# EAGLE design Płytka (EAGLE 9.6.2)
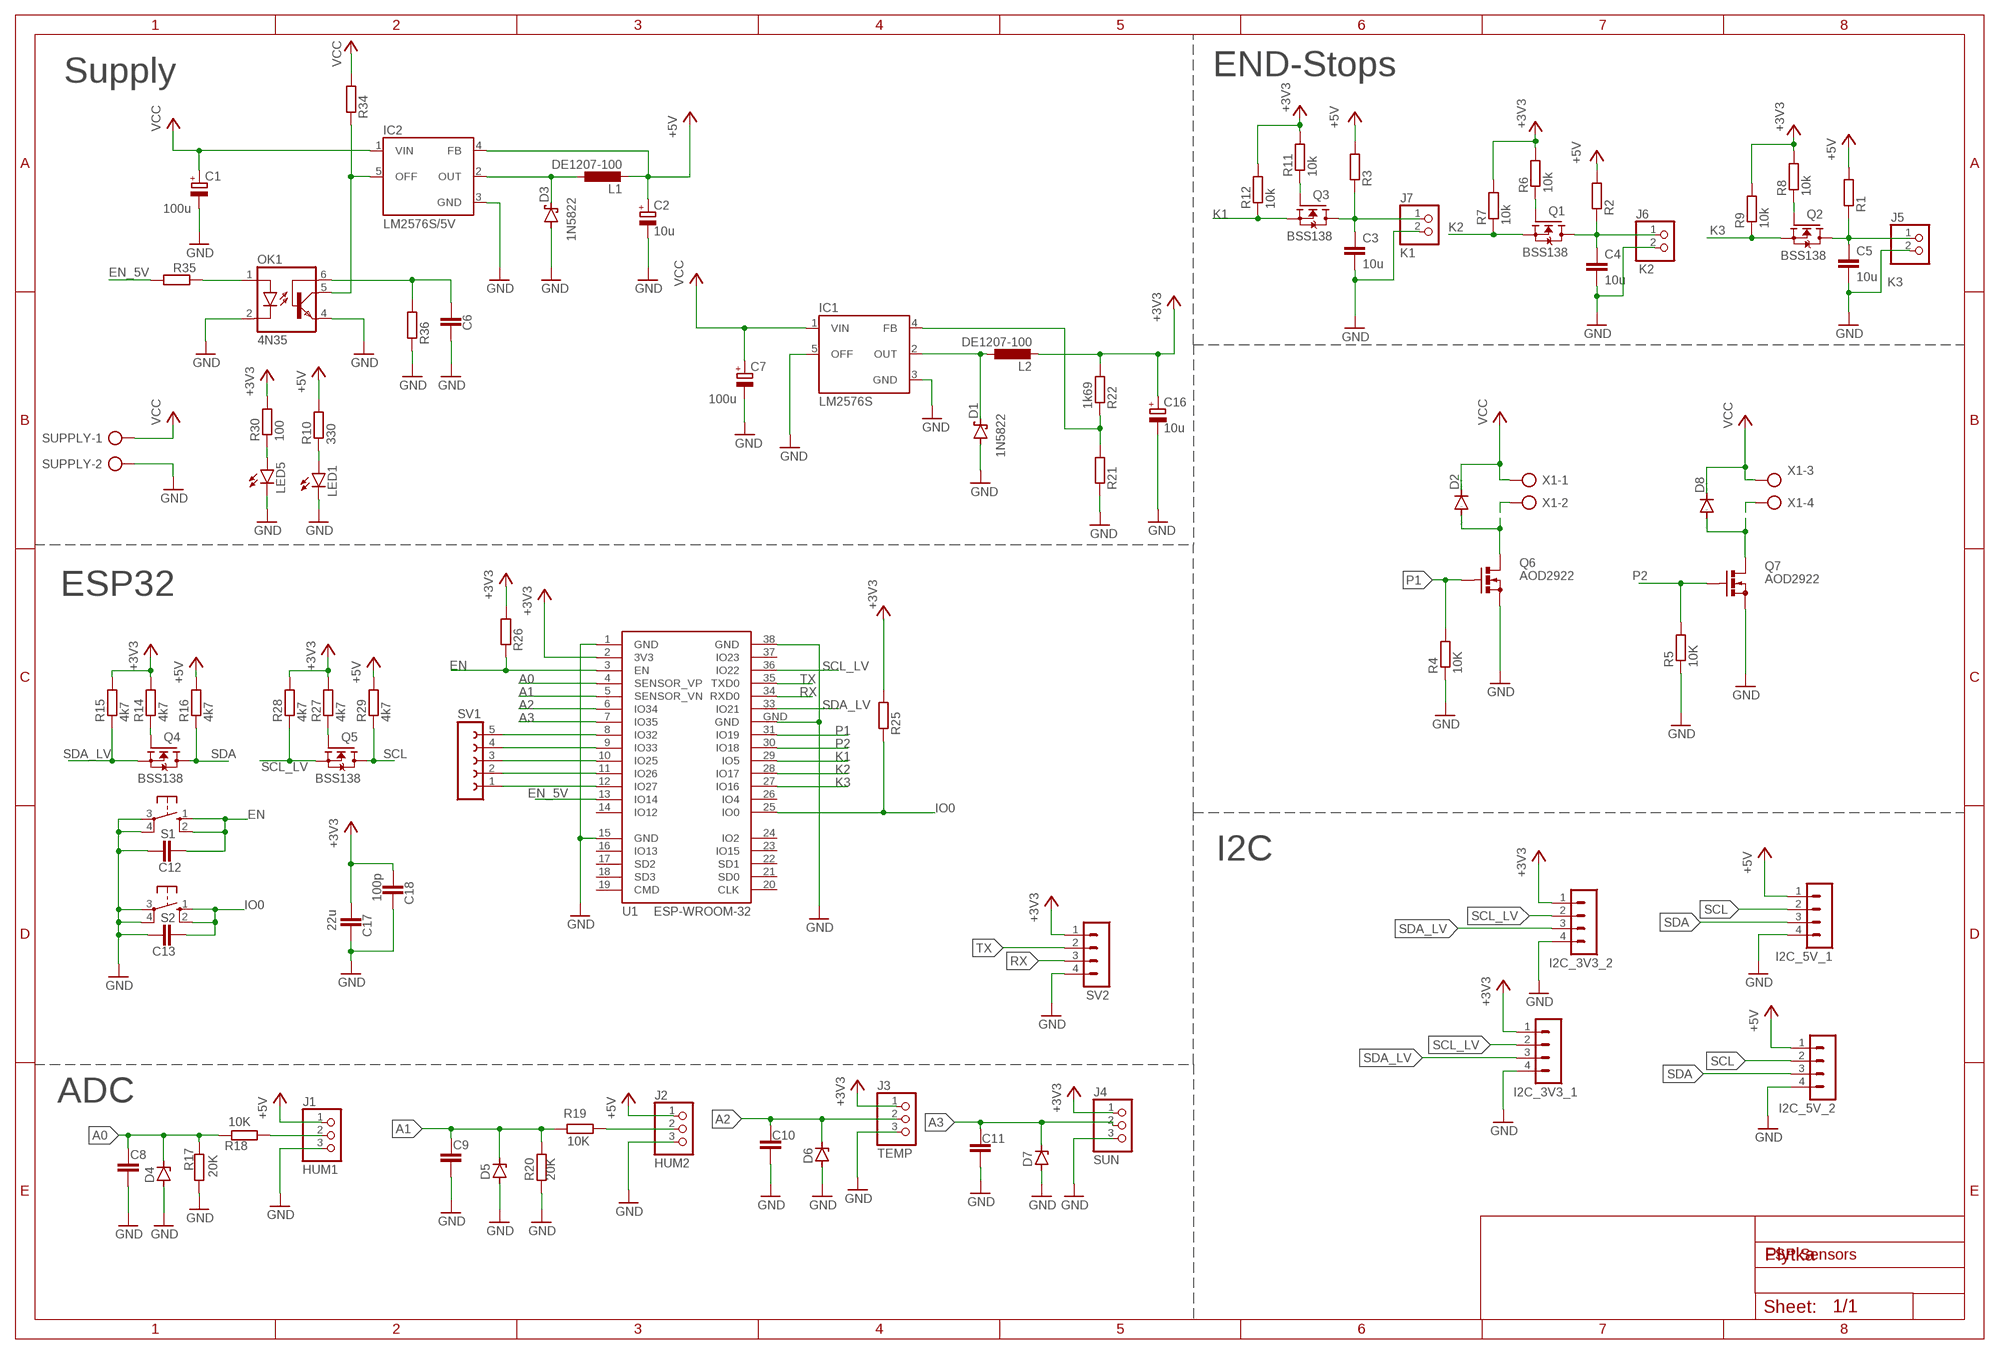
[diagram p0: schematic, sheet 1]

## Parts
C1  100u  CPOL-EUE2.5-6  [E2,5-6]
C2  10u  CPOL-EUE3.5-8  [E3,5-8]
C3  10u  C-EUC0805K  [C0805K]
C4  10u  C-EUC0805K  [C0805K]
C5  10u  C-EUC0805K  [C0805K]
C6  C-EUC0805K  [C0805K]
C7  100u  CPOL-EUE2.5-6  [E2,5-6]
C8  C-EUC0805K  [C0805K]
C9  C-EUC0805K  [C0805K]
C10  C-EUC0805K  [C0805K]
C11  C-EUC0805K  [C0805K]
C12  C-EUC0805K  [C0805K]
C13  C-EUC0805K  [C0805K]
C16  10u  CPOL-EUE3.5-8  [E3,5-8]
C17  22u  C-EUC0805K  [C0805K]
C18  100p  C-EUC0805K  [C0805K]
D1  1N5822  1N5908  [C4111-15]
D2  DIODE-DO214AC  [DO214AC]
D3  1N5822  1N5908  [C4111-15]
D4  ZENER-DIODESOD80C  [SOD80C]
D5  ZENER-DIODESOD80C  [SOD80C]
D6  ZENER-DIODESOD80C  [SOD80C]
D7  ZENER-DIODESOD80C  [SOD80C]
D8  DIODE-DO214AC  [DO214AC]
I2C_3V3_1  MA04-1  [MA04-1]
I2C_3V3_2  MA04-1  [MA04-1]
I2C_5V_1  MA04-1  [MA04-1]
I2C_5V_2  MA04-1  [MA04-1]
IC1  LM2576S  [TO263-5]
IC2  LM2576S/5V  LM2576T  [TO220-5]
J1  HUM1  WT-2MM-3PINSTRAIGHT  [W_TYPE_2MM_3_N]
J2  HUM2  WT-2MM-3PINSTRAIGHT  [W_TYPE_2MM_3_N]
J3  TEMP  WT-2MM-3PINSTRAIGHT  [W_TYPE_2MM_3_N]
J4  SUN  WT-2MM-3PINSTRAIGHT  [W_TYPE_2MM_3_N]
J5  K3  WT-2MM-2PINSTRAIGHT  [W_TYPE_2MM_2_N]
J6  K2  WT-2MM-2PINSTRAIGHT  [W_TYPE_2MM_2_N]
J7  K1  WT-2MM-2PINSTRAIGHT  [W_TYPE_2MM_2_N]
L1  DE1207-100  [DE1207]
L2  DE1207-100  [DE1207]
LED1  LEDSML0805  [SML0805]
LED5  LEDSML0805  [SML0805]
OK1  4N35  [DIL06]
Q1  BSS138  [SOT23]
Q2  BSS138  [SOT23]
Q3  BSS138  [SOT23]
Q4  BSS138  [SOT23]
Q5  BSS138  [SOT23]
Q6  AOD2922  MOSFET_NIXTY8N65X2  [TO252AA]
Q7  AOD2922  MOSFET_NIXTY8N65X2  [TO252AA]
R1  R-EU_R0805  [R0805]
R2  R-EU_R0805  [R0805]
R3  R-EU_R0805  [R0805]
R4  10K  R-EU_R0805  [R0805]
R5  10K  R-EU_R0805  [R0805]
R6  10k  R-EU_R0805  [R0805]
R7  10k  R-EU_R0805  [R0805]
R8  10k  R-EU_R0805  [R0805]
R9  10k  R-EU_R0805  [R0805]
R10  330  R-EU_R0805  [R0805]
R11  10k  R-EU_R0805  [R0805]
R12  10k  R-EU_R0805  [R0805]
R14  4k7  R-EU_R0805  [R0805]
R15  4k7  R-EU_R0805  [R0805]
R16  4k7  R-EU_R0805  [R0805]
R17  20K  R-EU_R0805  [R0805]
R18  10K  R-EU_R0805  [R0805]
R19  10K  R-EU_R0805  [R0805]
R20  20K  R-EU_R0805  [R0805]
R21  R-EU_R0805  [R0805]
R22  1k69  R-EU_R0805  [R0805]
R25  R-EU_R0805  [R0805]
R26  R-EU_R0805  [R0805]
R27  4k7  R-EU_R0805  [R0805]
R28  4k7  R-EU_R0805  [R0805]
R29  4k7  R-EU_R0805  [R0805]
R30  100  R-EU_R0805  [R0805]
R34  R-EU_R0805  [R0805]
R35  R-EU_R0805  [R0805]
R36  R-EU_R0805  [R0805]
S1  10-XX  [B3F-10XX]
S2  10-XX  [B3F-10XX]
SUPPLY  AK500/2-H  [AK500/2-H]
SV1  FE05-1  [FE05-1]
SV2  MA04-1  [MA04-1]
U1  ESP-WROOM-32  [ESP-WROOM-32]
X1  + P2  AK500/4  [AK500/4]

## Nets
+3V3: C16.+ C17.2 C18.2 I2C_3V3_1.1 I2C_3V3_2.1 J3.1 J4.1 L2.2 R6.2 R7.2 R8.2 R9.2 R11.2 R12.2 R14.2 R15.2 R22.2 R25.2 R26.2 R27.2 R28.2 R30.2 SV2.1 U1.2(3V3)
+5V: C2.+ I2C_5V_1.1 I2C_5V_2.1 IC2.4(FB) J1.1 J2.1 L1.2 R1.2 R2.2 R3.2 R10.2 R16.2 R29.2
A0: C8.1 D4.C R17.2 R18.2 U1.4(SENSOR_VP)
A1: C9.1 D5.C R19.2 R20.1 U1.5(SENSOR_VN)
A2: C10.1 D6.C J3.2 U1.6(IO34)
A3: C11.1 D7.C J4.2 U1.7(IO35)
EN: C12.2 R26.1 S1.1(S) S1.2(S1) U1.3(EN)
EN_5V: R35.2 U1.13(IO14)
GND: C1.- C2.- C3.2 C4.2 C5.2 C6.1 C7.- C8.2 C9.2 C10.2 C11.2 C12.1 C13.1 C16.- C17.1 C18.1 D1.A D3.A D4.A D5.A D6.A D7.A I2C_3V3_1.4 I2C_3V3_2.4 I2C_5V_1.4 I2C_5V_2.4 IC1.3(GND) IC1.5(OFF) IC2.3(GND) J1.3 J2.3 J3.3 J4.3 J5.2 J6.2 J7.2 LED1.C LED5.C OK1.2(C) OK1.4(EMI) Q6.2(S) Q7.2(S) R4.1 R5.1 R17.1 R20.2 R21.1 R36.1 S1.3(P) S1.4(P1) S2.3(P) S2.4(P1) SUPPLY.2 SV2.4 U1.1(GND) U1.15(GND) U1.38(GND) U1.GND
IO0: C13.2 R25.1 S2.1(S) S2.2(S1) U1.25(IO0)
K1: Q3.2(S) R12.1 U1.29(IO5)
K2: Q1.2(S) R7.1 U1.28(IO17)
K3: Q2.2(S) R9.1 U1.27(IO16)
N$1: C5.1 J5.1 Q2.3(D) R1.1
N$2: C4.1 J6.1 Q1.3(D) R2.1
N$3: LED1.A R10.1
N$4: Q4.1(G) R14.1
N$5: C3.1 J7.1 Q3.3(D) R3.1
N$6: D2.A Q6.3(D) X1.2
N$7: D8.A Q7.3(D) X1.4
N$8: Q5.1(G) R27.1
N$9: J1.2 R18.1
N$10: SV1.5 U1.8(IO32)
N$11: Q1.1(G) R6.1
N$12: SV1.4 U1.9(IO33)
N$13: Q2.1(G) R8.1
N$14: SV1.3 U1.10(IO25)
N$16: Q3.1(G) R11.1
N$17: SV1.2 U1.11(IO26)
N$18: J2.2 R19.1
N$19: D3.C IC2.2(OUT) L1.1
N$21: D1.C IC1.2(OUT) L2.1
N$22: SV1.1 U1.12(IO27)
N$23: LED5.A R30.1
N$25: IC2.5(OFF) OK1.5(COL) R34.1
N$26: OK1.1(A) R35.1
N$29: C6.2 OK1.6(BAS) R36.2
N$30: IC1.4(FB) R21.2 R22.1
P1: Q6.1(G) R4.2 U1.31(IO19)
P2: Q7.1(G) R5.2 U1.30(IO18)
RX: SV2.3 U1.34(RXD0)
SCL: I2C_5V_1.2 I2C_5V_2.2 Q5.3(D) R29.1
SCL_LV [U1]: I2C_3V3_1.2 I2C_3V3_2.2 Q5.2(S) R28.1 U1.36(IO22)
SDA: I2C_5V_1.3 I2C_5V_2.3 Q4.3(D) R16.1
SDA_LV [U1]: I2C_3V3_1.3 I2C_3V3_2.3 Q4.2(S) R15.1 U1.33(IO21)
TX: SV2.2 U1.35(TXD0)
VCC: C1.+ C7.+ D2.C D8.C IC1.1(VIN) IC2.1(VIN) R34.2 SUPPLY.1 X1.1 X1.3
Unconnected: U1.14(IO12) U1.16(IO13) U1.17(SD2) U1.18(SD3) U1.19(CMD) U1.20(CLK) U1.21(SD0) U1.22(SD1) U1.23(IO15) U1.24(IO2) U1.26(IO4) U1.37(IO23)

## Notes on the sheet
- Supply | END-Stops
- ESP32
- I2C
- ADC
- ESP Sensors

## Library data of the parts
C1 C2 C7 C16 = rcl:CPOL-EU: POLARIZED CAPACITOR, European symbol; SPICEPREFIX: C
C3-C6 C8-C13 C17 C18 = rcl:C-EU: CAPACITOR, European symbol; SPICEPREFIX: C
D1 D3 = diode:1N5908: DIODE schottky
D2 D8 = diode:DIODE-: DIODE
D4-D7 = diode:ZENER-DIODE: Z-Diode
I2C_3V3_1 I2C_3V3_2 I2C_5V_1 I2C_5V_2 SV2 = con-lstb:MA04-1: PIN HEADER; OC_FARNELL: unknown; OC_NEWARK: unknown
IC1 IC2 = v-reg-3:LM2576: National Semiconductor <http://www.national.com> 3.0A "Simple Switcher"(c) 52kHz, Vout 1.23-37V (HV: 57V), Vin 40V (HV: 60V), 50µA standby current
J1-J4 = PUTRocketLab_connectors:WT-2MM-3PIN
J5-J7 = PUTRocketLab_connectors:WT-2MM-2PIN
L1 L2 = ferrocore:DE1207-100: SMD power coil 100 uH
LED1 LED5 = led:LED: LED OSRAM: - CHIPLED LG R971, LG N971, LY N971, LG Q971, LY Q971, LO R971, LY R971 LH N974, LH R974 LS Q976, LO Q976, LY Q976 LO Q996 - Hyper CHIPLED LW Q18S LB Q993, LB Q99A, LB R99A - SideLED LS A670, LO A670, LY A670, LG A670, LP A670 LB A673, LV A673, LT A673, LW A673 LH A674 LY A675 LS A676, LA A676, LO A676, LY A676, LW A676 LS A679, LY A679, LG A679 - Hyper Micro SIDELED® LS Y876, LA Y876, LO Y876, LY Y876 LT Y87S - SmartLED LW L88C, LW L88S LB L89C, LB L89S, LG L890 LS L89K, LO L89K, LY L89K LS L896, LA L896, LO L896, LY L896 - TOPLED LS T670, LO T670, LY T670, LG T670, LP T670 LSG T670, LSP T670, LSY T670, LOP T670, LYG T670 LG T671, LOG T671, LSG T671 LB T673, LV T673, LT T673, LW T673 LH T674 LS T676, LA T676, LO T676, LY T676, LB T676, LH T676, LSB T676, LW T676 LB T67C, LV T67C, LT T67C, LS T67K, LO T67K, LY T67K, LW E67C LS E67B, LA E67B, LO E67B, LY E67B, LB E67C, LV E67C, LT E67C LW T67C LS T679, LY T679, LG T679 LS T770, LO T770, LY T770, LG T770, LP T770 LB T773, LV T773, LT T773, LW T773 LH T774 LS E675, LA E675, LY E675, LS T675 LS T776, LA T776, LO T776, LY T776, LB T776 LHGB T686 LT T68C, LB T68C - Hyper Mini TOPLED® LB M676 - Mini TOPLED Santana® LG M470 LS M47K, LO M47K, LY M47K Source: http://www.osram.convergy.de LUXEON: - LUMILED® LXK2-PW12-R00, LXK2-PW12-S00, LXK2-PW14-U00, LXK2-PW14-V00 LXK2-PM12-R00, LXK2-PM12-S00, LXK2-PM14-U00 LXK2-PE12-Q00, LXK2-PE12-R00, LXK2-PE12-S00, LXK2-PE14-T00, LXK2-PE14-U00 LXK2-PB12-K00, LXK2-PB12-L00, LXK2-PB12-M00, LXK2-PB14-N00, LXK2-PB14-P00, LXK2-PB14-Q00 LXK2-PR12-L00, LXK2-PR12-M00, LXK2-PR14-Q00, LXK2-PR14-R00 LXK2-PD12-Q00, LXK2-PD12-R00, LXK2-PD12-S00 LXK2-PH12-R00, LXK2-PH12-S00 LXK2-PL12-P00, LXK2-PL12-Q00, LXK2-PL12-R00 Source: www.luxeon.com KINGBRIGHT: KA-3528ASYC Source: www.kingbright.com
OK1 = optocoupler:4N35: MOTOROLA OPTO COUPLER; MF: FAIRCHILD SEMICONDUCTOR; MPN: 4N35; OC_FARNELL: 1328375; OC_NEWARK: 72K9946
Q1-Q5 = bss138_10:BSS138: BSS138 N-Channel Logic Level Enhancement Mode Field Effect Transistor Source: http://www.fairchildsemi.com/datasheets/BS/BSS138.pdf; MF: Fairchild; MPN: BSS138; OC_FARNELL: 9845330; OC_NEWARK: 67R2009
Q6 Q7 = Clean-Kong:MOSFET_N: SC70FL MOSFET Canal N, 20V 2A RS920-9805 Canal N : 3=S 2=G 1=D
R1-R12 R14-R22 R25-R30 R34-R36 = rcl:R-EU_: RESISTOR, European symbol; SPICEPREFIX: R
S1 S2 = switch-omron:10-XX: OMRON SWITCH; MPN: B3F-1000; OC_FARNELL: 176432; OC_NEWARK: 36M3542
SUPPLY = con-ptr500:AK500/2-H: CONNECTOR Aug. 2004 / PTR Meßtechnik: Die Bezeichnung der Serie AK505 wurde geändert. Es handelt sich hierbei um AK500 in horizontaler Ausführung.; OC_FARNELL: unknown; OC_NEWARK: unknown
SV1 = con-lsta:FE05-1: FEMALE HEADER; OC_FARNELL: unknown; OC_NEWARK: unknown
U1 = esp32:ESP-WROOM-32: Espressif Systems ESP-WROOM-32
X1 = con-ptr500:AK500/4: CONNECTOR; OC_FARNELL: unknown; OC_NEWARK: unknown

## Net classes
1 U1: width 0.203 mm

## Board
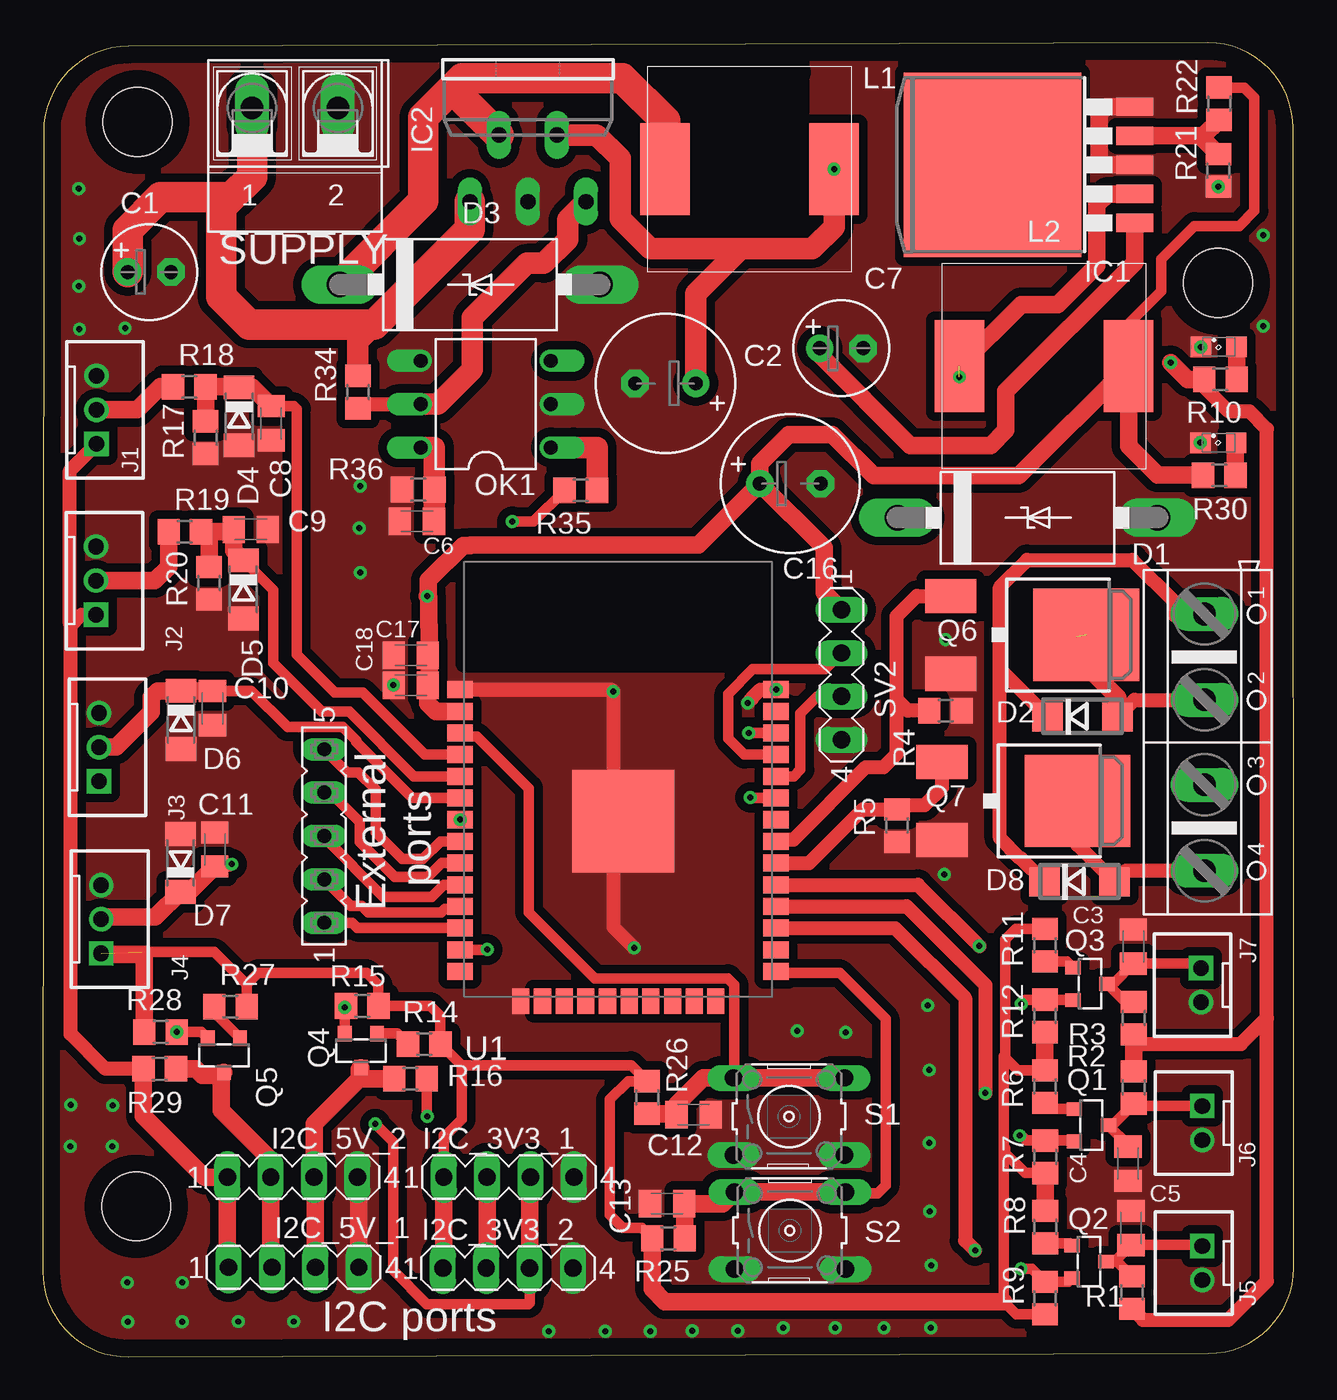
[diagram p1: board, top side]
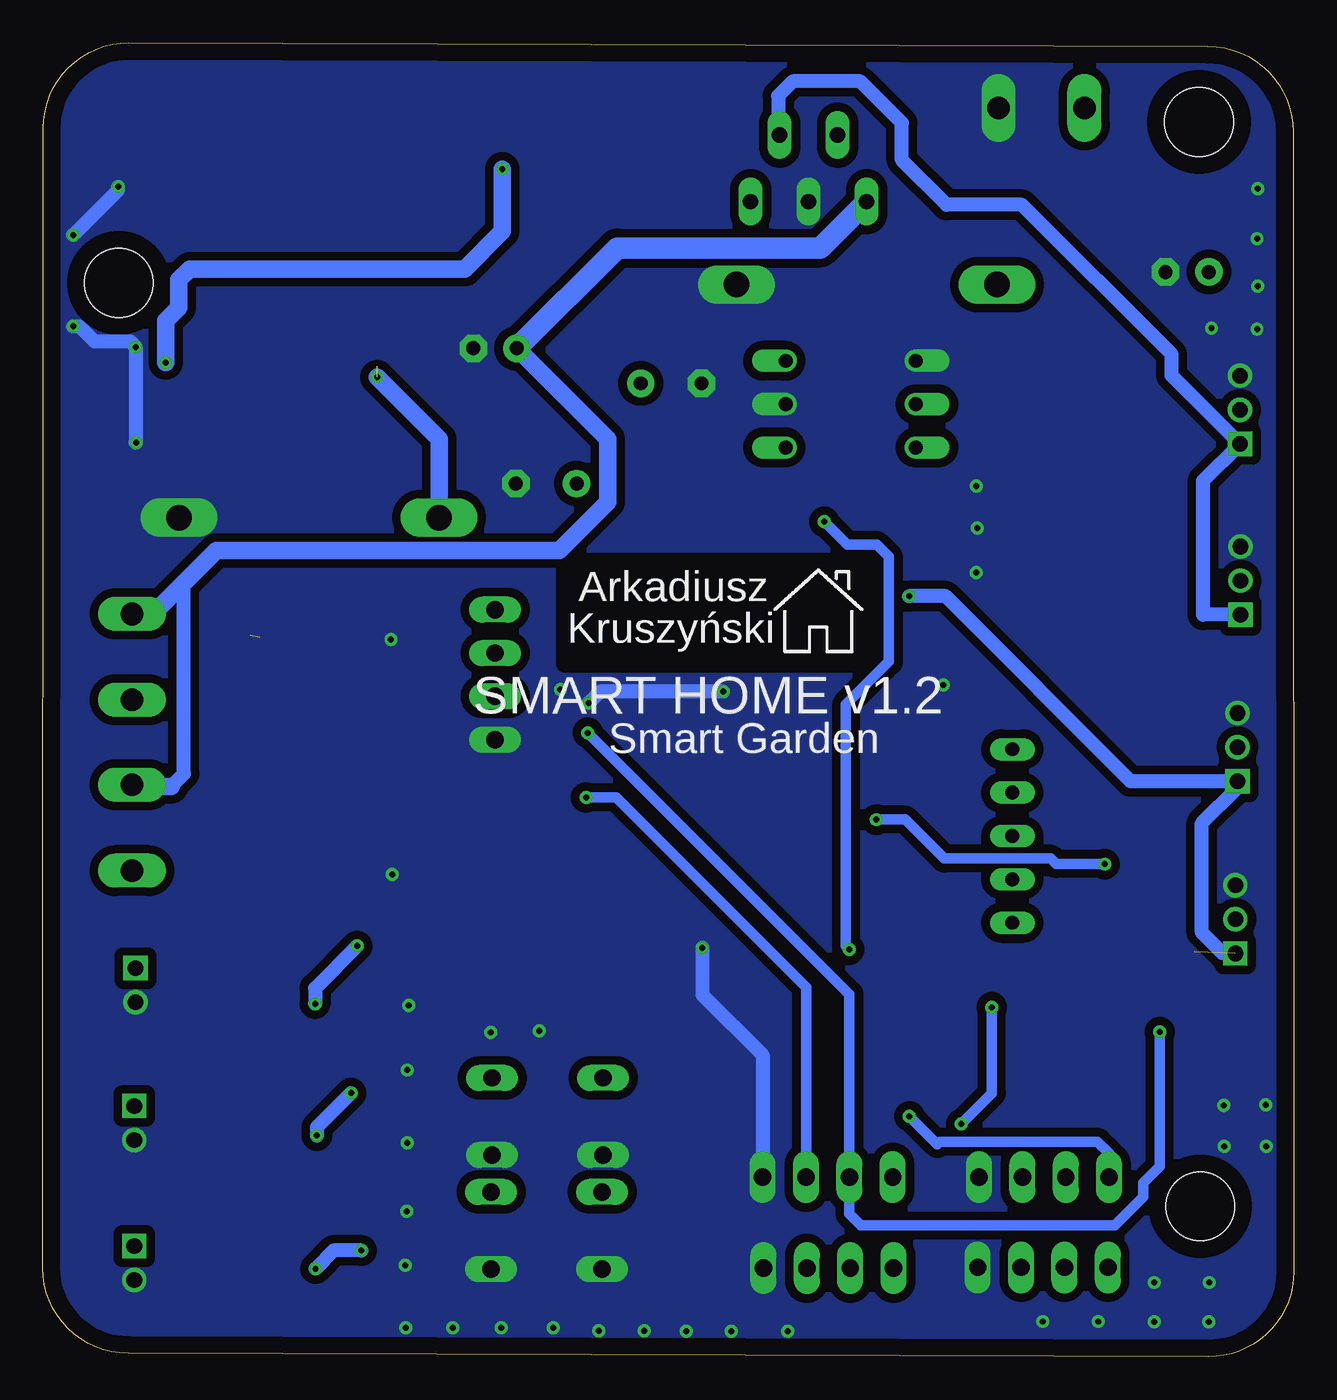
[diagram p2: board, bottom side, seen from below]

Size 73.28 x 77 mm. Coordinates in mm from the lower left corner, seen from the top.
Outline: 68.24,77 5.03,76.78 arc90 0.05,71.79 0,5 arc90 5.02,0 68.28,0.21 arc90 73.28,5.21 73.24,72 arc90 68.24,77
Copper layers (1*16): Top 0.035mm / dielectric 1.5mm / Bottom 0.035mm
Design rules "default *": minimum track width 6mil, minimum drill 0.35mm, track to track 12mil, track to pad 10mil, pad to pad 6mil, via to via 6mil, smd to smd 6mil, copper to edge 40mil, drill to drill 6mil, minimum pad ring 10mil, minimum via ring 8mil, stop-mask expansion 4mil, vias tented up to drill 0mil, thermal gap 10mil
Holes 4.01 mm at 5.56,72.35 5.48,8.82 68.83,62.93
tRestrict: area 38.3,66.6 to 44.1,75.2

### Footprints (pad centres in the part's own frame; a part is rotated, then mirrored left to right if it is on the bottom)
E2,5-6 = drill 0.813 pad 1.6: + -1.27,0 | drill 0.813 pad 1.6 octagon: - 1.27,0
E3,5-8 = drill 0.813 pad 1.6: + -1.778,0 | drill 0.813 pad 1.6 octagon: - 1.778,0
C0805K = smd 1.3 x 1.6: 1 -1,0; 2 1,0
C4111-15 = drill 1.499 long: A 7.62,0; C -7.62,0
DO214AC = smd 1.8 x 1.7: A 2.05,0; C -2.05,0
SOD80C = smd 1.4 x 1.8: A 1.7,0; C -1.7,0
MA04-1 = drill 1.016 long: 1 -3.81,0; 2 -1.27,0; 3 1.27,0; 4 3.81,0
TO263-5 = smd 1.067 x 2.159: 1 -3.404,-5.791; 2 -1.702,-5.791; 3 0,-5.791; 4 1.702,-5.791; 5 3.404,-5.791 | smd 10.8 x 10.41: 6 0,2.54
TO220-5 = drill 0.9 long: 1 -3.4,-8.4; 2 -1.7,-4.5; 3 0,-8.4; 4 1.7,-4.5; 5 3.4,-8.4
W_TYPE_2MM_3_N = drill 0.914 square: 1 -2,0 | drill 0.914: 2 0,0; 3 2,0
W_TYPE_2MM_2_N = drill 0.914 square: 1 -1,0 | drill 0.914: 2 1,0
DE1207 = smd 2.9 x 5.4: 1 -4.95,0; 2 4.95,0
SML0805 = smd 1.2 x 1.2: A 1.05,0; C -1.05,0
DIL06 = drill 0.813 offset: 1 -2.54,-3.81; 2 0,-3.81; 3 2.54,-3.81; 4 2.54,3.81; 5 0,3.81; 6 -2.54,3.81
SOT23 = smd 0.8 x 0.9: 1 -0.95,-1; 2 0.95,-1; 3 0,1
TO252AA = smd 2 x 3: 1 -2.28,-2.895; 2 2.28,-2.895 | smd 5.4 x 6.2: 3 0,5.04
R0805 = smd 1.3 x 1.5: 1 -0.95,0; 2 0.95,0
B3F-10XX = drill 1.016 long: 1 -3.251,2.261; 2 3.251,2.261; 3 -3.251,-2.261; 4 3.251,-2.261
AK500/2-H = drill 1.321 long: 1 -2.515,0; 2 2.515,0
FE05-1 = drill 0.813 long: 1 -5.08,0; 2 -2.54,0; 3 0,0; 4 2.54,0; 5 5.08,0
ESP-WROOM-32 = smd 1.5 x 1: 1 -9.25,7; 2 -9.25,5.73; 3 -9.25,4.46; 4 -9.25,3.19; 5 -9.25,1.92; 6 -9.25,0.65; 7 -9.25,-0.62; 8 -9.25,-1.89; 9 -9.25,-3.16; 10 -9.25,-4.43; 11 -9.25,-5.7; 12 -9.25,-6.97; 13 -9.25,-8.24; 14 -9.25,-9.51; 25 9.25,-9.51; 26 9.25,-8.24; 27 9.25,-6.97; 28 9.25,-5.7; 29 9.25,-4.43; 30 9.25,-3.16; 31 9.25,-1.89; 32 9.25,-0.62; 33 9.25,0.65; 34 9.25,1.92; 35 9.25,3.19; 36 9.25,4.46; 37 9.25,5.73; 38 9.25,7 | smd 1 x 1.5: 15 -5.7,-11.25; 16 -4.43,-11.25; 17 -3.16,-11.25; 18 -1.89,-11.25; 19 -0.62,-11.25; 20 0.65,-11.25; 21 1.92,-11.25; 22 3.19,-11.25; 23 4.46,-11.25; 24 5.73,-11.25 | smd 6 x 6: GND 0.3,-0.7
AK500/4 = drill 1.321 long: 1 -7.518,0; 2 -2.489,0; 3 2.489,0; 4 7.518,0

### Placement (x,y rotation side)
C1  6.24,63.56 0 top
C2  36.47,57.03 180 top
C3  63.88,24.04 90 top
C4  63.57,11.31 270 top
C5  63.75,7.55 90 top
C6  21.92,48.96 0 top
C7  46.78,59.09 0 top
C8  13.38,54.7 270 top
C9  12.19,48.47 0 top
C10  9.95,38.01 270 top
C11  10.08,29.73 90 top
C12  38.12,14.18 180 top
C13  36.57,8.98 0 top
C16  43.79,51.17 0 top
C17  21.56,41.11 0 top
C18  21.56,39.36 0 top
D1  57.68,49.16 0 top
D2  60.91,37.5 0 top
D3  25.02,62.82 0 top
D4  11.5,55.1 270 top
D5  11.76,44.97 270 top
D6  8.1,37.32 270 top
D7  8.07,28.94 90 top
D8  60.73,27.82 0 top
I2C_3V3_1  27.3,10.53 0 top
I2C_3V3_2  27.25,5.19 0 top
I2C_5V_1  14.7,5.24 0 top
I2C_5V_2  14.63,10.53 0 top
IC1  58.16,69.84 90 top
IC2  28.42,76.08 0 top
J1  3.15,55.48 90 top
J2  3.12,45.48 90 top
J3  3.3,35.72 90 top
J4  3.43,25.64 90 top
J5  67.92,5.5 270 top
J6  67.92,13.7 270 top
J7  67.84,21.78 270 top
L1  41.4,69.58 0 top
L2  58.64,58.05 0 top
LED1  68.88,59.17 0 top
LED5  68.86,53.55 0 top
OK1  25.96,55.81 90 top
Q1  61.41,13.57 270 top
Q2  61.29,5.57 270 top
Q3  61.34,21.85 270 top
Q4  18.64,17.94 180 top
Q5  10.61,17.66 180 top
Q6  56.08,42.3 270 top
Q7  55.57,32.57 270 top
R1  63.8,3.77 270 top
R2  63.9,15.78 90 top
R3  63.9,19.85 270 top
R4  52.88,37.86 180 top
R5  50.03,31.13 90 top
R6  58.7,15.83 90 top
R7  58.72,11.72 270 top
R8  58.72,7.61 90 top
R9  58.7,3.44 270 top
R10  68.98,57.26 180 top
R11  58.7,24.12 90 top
R12  58.7,19.97 270 top
R14  22.35,18.32 0 top
R15  18.72,20.56 0 top
R16  21.54,16.29 0 top
R17  9.55,53.86 90 top
R18  8.58,56.83 0 top
R19  8.33,48.35 0 top
R20  9.75,45.32 270 top
R21  68.86,69.5 90 top
R22  68.91,73.42 90 top
R25  36.65,6.94 180 top
R26  35.4,15.2 90 top
R27  10.99,20.51 0 top
R28  6.91,19.04 180 top
R29  6.85,16.88 180 top
R30  68.91,51.65 180 top
R34  18.46,56.53 90 top
R35  31.52,50.76 180 top
R36  21.99,50.81 0 top
S1  43.71,14.08 0 top
S2  43.76,7.4 0 top
SUPPLY  14.78,73.16 0 top
SV1  16.48,30.52 90 top
SV2  46.78,39.96 270 top
U1  33.7,32.09 0 top
X1  68.04,36 270 top

### Tracks (layer width: path | path; a pad name or v marks a point on that pad's centre or on a via)
+3V3  (via drill 0.35)  (1 unrouted)
  Top 0.61: R6.2 57.11,16.78 56.38,17.51 | 56.38,17.51 56.38,24.45 57,25.07 R11.2 | R7.2 57.54,10.77 56.38,11.92 56.38,12.23 56.28,12.13 | 56.28,12.13 56.28,17.61 56.38,17.51 | R9.2 57.03,2.49 56.28,3.24 56.28,12.13 | 24.53,17.09 R14.2 23.3,19.96 22.7,20.56 R15.2 19.67,21.79 18.97,22.49 12.61,22.49 11.94,21.82 | 24.53,17.09 24.53,13.9 23.62,12.99 23.52,12.99 23.49,12.96 I2C_3V3_1.1 | 24.53,17.09 34.46,17.09 R26.2 34.3,16.15 33.22,15.07 33.22,8.32 33.98,7.55 35.09,7.55 R25.2 | R27.2 11.94,21.82 | 5.83,23.72 10.04,23.72 11.94,21.82 | L2.2 63.59,60.54 65.5,62.44 65.5,64.3 67.45,66.25 70.07,66.25 70.96,67.14 70.96,73.77 70.37,74.37 R22.2 | C17.2 22.65,41.2 | 22.6,42.81 22.65,42.81 | C18.2 22.65,39.36
  Top 1.016: C16.+ 42.01,52.33 43.71,54.04 46.25,54.04 48.66,51.62 57.17,51.62 L2.2 63.59,53.35 65.3,51.65 R30.2 | C16.+ 38.4,47.56 25.06,47.56 25.05,47.55 24.62,47.55 22.58,45.5 22.58,44.61 v22.53,44.56 22.6,44.49 22.6,42.81 | 22.65,42.81 22.65,41.2 22.65,39.36 | R28.2 5.95,23.59 3.47,23.59 J4.1 | I2C_3V3_1.1 23.49,5.24 I2C_3V3_2.1 | R8.2 R7.2 | R6.2 R12.2 | U1.2 23.02,37.82 22.56,38.28 C18.2 | SV2.1 45.77,44.79 45.77,47.41 C16.+ | 56.28,3.24 36.45,3.24 35.7,3.98 R25.2
  Bottom 0.813: J4.1 4.17,23.64 5.38,24.85 5.38,31.28 3.3,33.36 J3.1 9.55,33.72 20.39,44.56 v22.53,44.56
+5V  (via drill 0.35)
  Top 0.61: v22.51,14.1 22.49,14.12 R16.2
  Top 0.813: R3.2 64.48,18.32 70.18,18.32 71.7,19.85 | 71.7,19.85 71.7,54.37 70.68,55.38 69.48,55.38 68.03,56.83 R10.2 | R1.2 64.45,2.17 69.43,2.17 71.7,4.44 71.7,19.85 | R29.2 3.67,16.88 1.64,18.91 1.64,42.85 | 1.64,42.85 1.64,43 1.59,42.95 1.59,51.92 J1.1 | J2.1 2.26,43.48 1.64,42.85
  Top 1.016: R10.2 67.05,57.26 v66.06,58.25 | I2C_5V_1.1 10.82,5.32 I2C_5V_2.1 9.5,10.53 5.9,14.12 R29.2 | R2.2 R3.2
  Top 1.27: IC2.4 32.46,71.58 33.83,70.22 33.83,66.69 35.58,64.93 40.89,64.93 | L1.2 46.35,66.2 45.08,64.93 40.89,64.93 | C2.+ 38.25,62.29 40.89,64.93
  Bottom 0.61: I2C_5V_2.1 10.82,11.92 11.5,12.61 20.72,12.61 20.87,12.46 v22.51,14.1
  Bottom 0.813: J2.1 5.3,43.48 5.3,51.33 J1.1 7.16,57.5 7.16,58.74 15.92,67.5 20.34,67.5 22.96,70.11 22.96,72.3 25.4,74.74 29.33,74.74 30.2,73.87 30.2,71.66 IC2.4
  Bottom 1.016: v66.06,58.25 66.06,60.7 65.3,61.46 65.3,63.1 64.66,63.74 48.56,63.74 46.35,65.95 L1.2
  other vias: 46.35,69.58
A0
  Top 0.61: U1.4 22.38,35.28 18.74,38.92 17.12,38.92 14.88,41.16 14.88,55.54 14.72,55.7 C8.1
  Top 1.016: R17.2 9.55,56.82 R18.2 11.48,56.83 D4.C 12.28,56.8 C8.1
A1
  Top 0.61: U1.5 21.74,34.01 17.95,37.81 16.35,37.81 13.51,40.65 13.51,44.92 D5.C
  Top 1.016: R20.1 9.75,47.87 R19.2 11.06,48.35 C9.1 11.19,47.24 D5.C
A2
  Top 0.61: C10.1 12.23,39.01 14.35,36.89 17.57,36.89 18.36,36.1 18.36,36.03 21.65,32.74 U1.6
  Top 1.016: J3.2 4.31,35.72 6.37,37.78 6.37,38.67 6.73,39.02 D6.C 9.94,39.02 C10.1
A3  (via drill 0.35)
  Top 0.61: C11.1 10.93,28.73 v11.07,28.87
  Top 1.016: J4.2 3.55,25.77 6.6,25.77 D7.C 8.59,27.24 C11.1
  Bottom 0.61: v11.07,28.87 13.92,28.87 14.25,29.2 20.47,29.2 22.74,31.47 U1.7
  other vias: 24.45,31.47
EN
  Top 0.61: U1.3 24.66,36.34 25.43,36.34 28.47,33.3 28.47,26.05 32.33,22.18 40.13,22.18 40.51,21.8 40.51,16.39 S1.1
  Top 1.016: R26.1 37.06,14.25 C12.2 37.12,14.78 38.68,16.34 S1.1 S1.2
EN_5V  (via drill 0.35)
  Top 0.61: R35.2 28.74,48.93 v27.5,48.93 | v26.03,23.86 v26.02,23.85 U1.13
  Bottom 0.61: v27.5,48.93 26.16,47.58 24.43,47.58 23.72,46.87 23.72,40.73 26.23,38.21 26.23,24.06 v26.03,23.86
GND  (via drill 0.35, 0.35 pad 0.55)
  Top 0.813: U1.1 33.31,39.09 v33.42,38.97 33.42,25.18 v34.64,23.96 | v41.3,38.31 41.54,38.56 41.54,38.59 42.04,39.09 U1.38
  Top 1.016: IC1.3 62.07,69.84 61.87,70.04 61.87,72.83 62.28,73.24 IC1.5 | I2C_5V_1.4 18.51,10.45 I2C_5V_2.4
  Bottom 0.813: v71.5,65.72 68.86,68.36 R21.1 | v71.5,60.39 71.14,60.39 70.25,59.5 68.16,59.5 LED1.C 67.83,53.58 LED5.C | v33.42,38.97 40.64,38.97 v41.3,38.31 | v34.64,23.96 34.64,21.22 31.11,17.69 I2C_3V3_1.4
  other vias: 68.86,68.55 43.38,1.71 40.71,1.53 38.05,1.53 35.58,1.51 46.43,1.71 49.27,1.71 52.02,1.71 8.18,2.04 11.45,2.07 14.7,2.07 4.97,2.04 4.95,4.35 8.18,4.35 1.65,14.77 4.11,14.74 1.62,12.33 4.09,12.33 32.94,1.51 29.64,1.51 67.83,59.17 67.81,53.55 42.95,39.09 52.04,5.37 51.96,8.52 51.91,12.53 51.91,16.8 51.84,20.58 47.04,19.01 44.19,19.09 52.8,28.26 20.54,39.36 2.16,60.21 2.1,62.72 2.16,65.52 2.1,68.44 4.82,60.26 18.59,51.01 18.54,48.55 18.59,45.96 52.88,42.02
  pour Bottom (isolate 0.508, no thermals): -9.12,74.86 -9.12,8.52 arc45 -6.19,1.45 2.31,-7.05 69.92,-7.05 arc45 76.99,-4.12 86.76,5.65 86.76,60.56 arc45 83.83,67.63 77.24,74.23 71.28,80.19 arc45 64.21,83.12 18.18,83.12 2.64,83.12 arc45 -4.43,80.19 -9.12,75.5
  pour Top (isolate 0.508, no thermals): 20.72,86.93 14.37,86.93 -7.22,65.34 -7.22,1.2 -4.04,-1.97 6.12,-12.13 58.19,-12.13 72.79,-12.13 91.84,6.92 91.84,69.15 90.57,70.42 74.06,86.93
IO0
  Top 0.61: U1.25 43.04,22.49 46.68,22.49 49.37,19.8 49.37,10.04 48.92,9.59 47.09,9.59 S2.2
  Top 1.016: R25.1 37.6,8.95 C13.2 39.82,8.98 S2.1 S2.2
K1  (via drill 0.35)
  Top 0.61: Q3.2 60.32,20.93 R12.1 57.56,20.93 v57.32,20.69
  Top 0.813: U1.29 51.26,27.66 v54.86,24.06
  Bottom 0.813: v54.86,24.06 57.32,21.6 v57.32,20.69
K2  (via drill 0.35)
  Top 0.61: Q1.2 60.37,12.67 R7.1 57.59,12.67 57.3,12.96 v57.22,12.96
  Top 0.813: U1.28 50.6,26.39 55.22,21.78 v55.22,15.45
  Bottom 0.813: v55.22,15.45 57.22,13.45 v57.22,12.96
K3  (via drill 0.35)
  Top 0.61: Q2.2 60.05,4.39 R9.1 57.92,5.17 v57.3,5.17
  Top 0.813: U1.27 49.92,25.12 54.02,21.02 54.02,6.82 v54.61,6.23
  Bottom 0.813: v54.61,6.23 56.23,6.23 v57.3,5.17
N$1
  Top 0.61: R1.1 62.95,5.57 Q2.3 62.77,5.57 C5.1 67.86,6.55 J5.1
N$2
  Top 0.61: C4.1 63.57,12.42 Q1.3 62.64,13.57 R2.1 64.04,14.7 J6.1
N$3
  Top 1.016: R10.1 LED1.A
N$4
  Top 0.61: Q4.1 20.78,18.94 R14.1
N$5
  Top 0.61: R3.1 63.39,20.8 Q3.3 62.69,21.85 C3.1 67.58,23.04 J7.1
N$6  (1 unrouted)
  Top 0.813: 60.58,42.17 59.51,41.11 | D2.A 63.95,38.49 X1.2
  Top 1.016: Q6.3 61.12,40.46 62.96,38.63 D2.A
N$7
  Top 0.813: Q7.3 60.61,29.99 D8.A 63.44,28.48 X1.4
N$8
  Top 0.61: Q5.1 10.04,20.18 R27.1
N$9
  Top 1.016: J1.2 5.53,55.48 6.88,56.83 R18.1
N$10
  Top 0.61: U1.8 23.3,30.2 22.27,29.17 21.05,29.17 19.5,30.72 19.5,33.23 18.49,34.25 17.83,34.25 SV1.5
N$11
  Top 0.61: R6.1 59.06,14.52 Q1.1
N$12
  Top 0.61: U1.9 23.38,28.93 22.55,28.1 20.62,28.1 18.56,30.16 18.56,31.33 16.84,33.06 SV1.4
N$13
  Top 0.61: R8.1 60.15,6.66 Q2.1
N$14
  Top 0.61: U1.10 23.48,27.66 22.78,26.96 19.96,26.96 16.48,30.44 SV1.3
N$16
  Top 0.61: R11.1 59.98,23.17 Q3.1
N$17
  Top 0.61: SV1.2 18.03,26.43 18.69,26.43 19.07,26.05 23.34,26.05 23.54,26.25 24.31,26.25 U1.11
N$18
  Top 1.016: J2.2 6.57,45.48 7.38,46.28 R19.1
N$19
  Top 1.778: L1.1 36.45,72.42 33.96,74.92 24.58,74.92 | D3.C 22.3,67.73 22.3,72.63 24.58,74.92 | IC2.2 24.58,73.72 24.58,74.92
N$21  (via drill 0.35)  (1 unrouted)
  Top 1.016: IC1.2 62.38,68.13 61.74,67.5 61.74,63.94 59.46,61.66 57.3,61.66 L2.1
  Bottom 1.016: D1.C 50.06,53.78 v53.69,57.41
N$22
  Top 0.61: SV1.1 18.13,25.44 18.44,25.13 24.24,25.13 24.34,25.23
  Top 0.813: 24.34,25.23 U1.12
N$23
  Top 1.016: R30.1 69.86,53.5 LED5.A
N$25
  Top 0.61: R34.1 18.7,55.81
  Top 0.813: 18.7,55.81 OK1.5
  Top 1.27: IC2.5 30.76,66.62 30.76,65.47 29.36,64.07 28.34,64.07 25.17,60.89 25.17,57.85 23.14,55.81 OK1.5
N$26
  Top 1.27: R35.1 32.47,53.27 OK1.1
N$29
  Top 1.27: OK1.6 22.94,53.27 R36.2 22.94,48.98 C6.2
N$30
  Top 1.016: IC1.4 67.77,71.54 | 67.77,71.54 R21.2 | 67.77,71.54 67.98,71.54 R22.1
P1
  Top 0.813: R4.2 50.67,37.86 50.01,38.52 | 50.01,38.52 50.01,43.39 51.2,44.58 Q6.1 | U1.31 43.06,30.31 43.98,30.31 48.22,34.55 49.25,34.55 50.01,35.32 50.01,38.52
P2
  Top 0.813: Q7.1 52.68,33.34 51.66,32.32 50.28,32.32 R5.2 48.04,32.08 44.89,28.93 U1.30
RX
  Top 0.61: U1.34 43.98,34.01 44.37,34.4 44.37,37.7 45.36,38.69 SV2.3
SCL
  Top 1.016: R29.1 8.96,16.88 9.34,16.5 10.44,16.5 | 10.44,16.5 Q5.3 | I2C_5V_1.2 13.36,5.32 I2C_5V_2.2 13.36,11.54 10.44,14.45 10.44,16.5
SCL_LV  (via drill 0.35)
  Top 0.61: Q5.2 9.29,19.04 R28.1 | U1.36 v41.36,36.55 v41.35,36.56
  Top 1.016: I2C_3V3_1.2 26.03,5.24 I2C_3V3_2.2
  Bottom 0.61: v41.35,36.56 26.03,21.25 I2C_3V3_1.2 26.03,8.37 25.37,7.71 10.49,7.71 8.81,9.38 8.81,10.2 7.85,11.16 R28.1
  other vias: 7.86,19.04
SDA
  Top 1.016: I2C_5V_1.3 15.97,10.45 I2C_5V_2.3 15.9,13.65 18.54,16.29 | R16.1 18.54,16.29 | 18.54,16.29 18.54,16.84 Q4.3
SDA_LV  (via drill 0.35)
  Top 0.61: Q4.2 v17.69,20.48 R15.1 | U1.33 41.48,32.74 v41.45,32.78 | I2C_3V3_2.3 28.52,3.16 28.44,3.08 22.5,3.08 20.52,5.07 20.52,12.61 v19.48,13.65
  Top 1.016: I2C_3V3_2.3 28.52,10.48 I2C_3V3_1.3
  Bottom 0.61: v19.48,13.65 17.69,15.44 v17.69,20.48 | I2C_3V3_1.3 28.57,21.65 39.7,32.78 v41.45,32.78
TX
  Top 0.61: U1.35 41.1,35.28 40.15,36.23 40.15,38.85 41.59,40.29 42.83,40.29 42.84,40.3 45.84,40.3 SV2.2
VCC
  Top 0.813: D2.C 56.05,40.3 | 66.37,43.52 66.37,44.16 63.83,46.7 57.65,46.7 56.05,45.1 56.05,40.3 | D8.C 57.29,29.21 57.24,29.21 56.05,30.4 56.05,40.3
  Top 1.016: IC1.1 63.95,64.12 56.41,56.58 56.41,54.29 55.52,53.4 50.82,53.4 45.51,58.71 C7.+ | 66.37,43.52 X1.1
  Top 1.27: R34.2 18.46,59.52 19.43,60.49
  Top 1.778: C1.+ 4.97,66.03 6.88,67.93 11.05,67.93 | 11.05,67.93 12.26,69.15 SUPPLY.1 | IC2.1 25.02,66.08 19.43,60.49 12.09,60.49 10.46,62.11 10.46,67.35 11.05,67.93
  Bottom 0.813: 65.76,33.41 65.01,34.16 65.01,45.34
  Bottom 1.016: X1.1 66.82,43.52 65.01,45.34 63.12,47.23 43.02,47.23 40.18,50.07 40.18,53.76 C7.+ | 65.76,33.41 67.94,33.41 X1.3
  Bottom 1.27: C7.+ 39.64,64.96 30.73,64.96 30.72,64.96 27.74,64.96 IC2.1

### Text on the board
tNames: External / ports | I2C ports
bNames: Arkadiusz | Kruszyński | SMART HOME v1.2 | Smart Garden